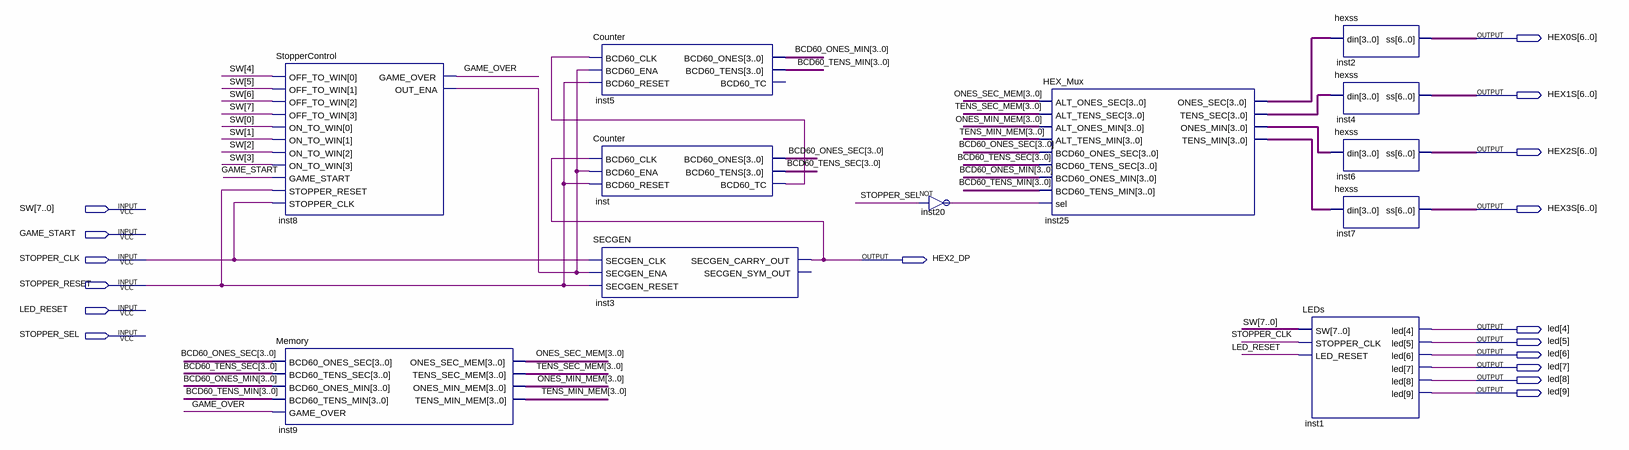
[diagram p0: schematic sheet]
// Quartus schematic Game.bdf as structural Verilog: 12 symbols, 17 pins
module Game (
  input  [7:0] SW,
  input  GAME_START,
  input  STOPPER_CLK,
  input  STOPPER_RESET,
  input  LED_RESET,
  input  STOPPER_SEL,
  output [6:0] HEX0S,
  output [6:0] HEX1S,
  output [6:0] HEX2S,
  output [6:0] HEX3S,
  output HEX2_DP,
  output [9:4] led
);

  wire GAME_OVER, inst8_out_ena, inst20_out, inst_bcd60_tc;
  wire [3:0] BCD60_ONES_MIN, BCD60_ONES_SEC, BCD60_TENS_MIN, BCD60_TENS_SEC, inst25_ones_min,
       inst25_ones_sec, inst25_tens_min, inst25_tens_sec, ONES_MIN_MEM, ONES_SEC_MEM, TENS_MIN_MEM,
       TENS_SEC_MEM;

  StopperControl inst8 (
    .OFF_TO_WIN(SW[7:4]), .ON_TO_WIN(SW[3:0]), .GAME_START(GAME_START), .STOPPER_RESET(STOPPER_RESET),
    .STOPPER_CLK(STOPPER_CLK), .GAME_OVER(GAME_OVER), .OUT_ENA(inst8_out_ena));
  Memory inst9 (
    .BCD60_ONES_SEC(BCD60_ONES_SEC), .BCD60_TENS_SEC(BCD60_TENS_SEC), .BCD60_ONES_MIN(BCD60_ONES_MIN),
    .BCD60_TENS_MIN(BCD60_TENS_MIN), .GAME_OVER(GAME_OVER), .ONES_SEC_MEM(ONES_SEC_MEM),
    .TENS_SEC_MEM(TENS_SEC_MEM), .ONES_MIN_MEM(ONES_MIN_MEM), .TENS_MIN_MEM(TENS_MIN_MEM));
  Counter inst5 (
    .BCD60_CLK(inst_bcd60_tc), .BCD60_ENA(inst8_out_ena), .BCD60_RESET(STOPPER_RESET),
    .BCD60_ONES(BCD60_ONES_MIN), .BCD60_TENS(BCD60_TENS_MIN));  // open: BCD60_TC
  Counter inst (
    .BCD60_CLK(HEX2_DP), .BCD60_ENA(inst8_out_ena), .BCD60_RESET(STOPPER_RESET), .BCD60_ONES(BCD60_ONES_SEC),
    .BCD60_TENS(BCD60_TENS_SEC), .BCD60_TC(inst_bcd60_tc));
  SECGEN inst3 (
    .SECGEN_CLK(STOPPER_CLK), .SECGEN_ENA(inst8_out_ena), .SECGEN_RESET(STOPPER_RESET),
    .SECGEN_CARRY_OUT(HEX2_DP));  // open: SECGEN_SYM_OUT
  not inst20 (inst20_out, STOPPER_SEL);
  HEX_Mux inst25 (
    .ALT_ONES_SEC(ONES_SEC_MEM), .ALT_TENS_SEC(TENS_SEC_MEM), .ALT_ONES_MIN(ONES_MIN_MEM),
    .ALT_TENS_MIN(TENS_MIN_MEM), .BCD60_ONES_SEC(BCD60_ONES_SEC), .BCD60_TENS_SEC(BCD60_TENS_SEC),
    .BCD60_ONES_MIN(BCD60_ONES_MIN), .BCD60_TENS_MIN(BCD60_TENS_MIN), .sel(inst20_out),
    .ONES_SEC(inst25_ones_sec), .TENS_SEC(inst25_tens_sec), .ONES_MIN(inst25_ones_min),
    .TENS_MIN(inst25_tens_min));
  LEDs inst1 (.SW(SW), .STOPPER_CLK(STOPPER_CLK), .LED_RESET(LED_RESET), .led(led));
  hexss inst2 (.din(inst25_ones_sec), .ss(HEX0S));
  hexss inst4 (.din(inst25_tens_sec), .ss(HEX1S));
  hexss inst6 (.din(inst25_ones_min), .ss(HEX2S));
  hexss inst7 (.din(inst25_tens_min), .ss(HEX3S));
endmodule
